# EAGLE design tester (EAGLE 6.3)
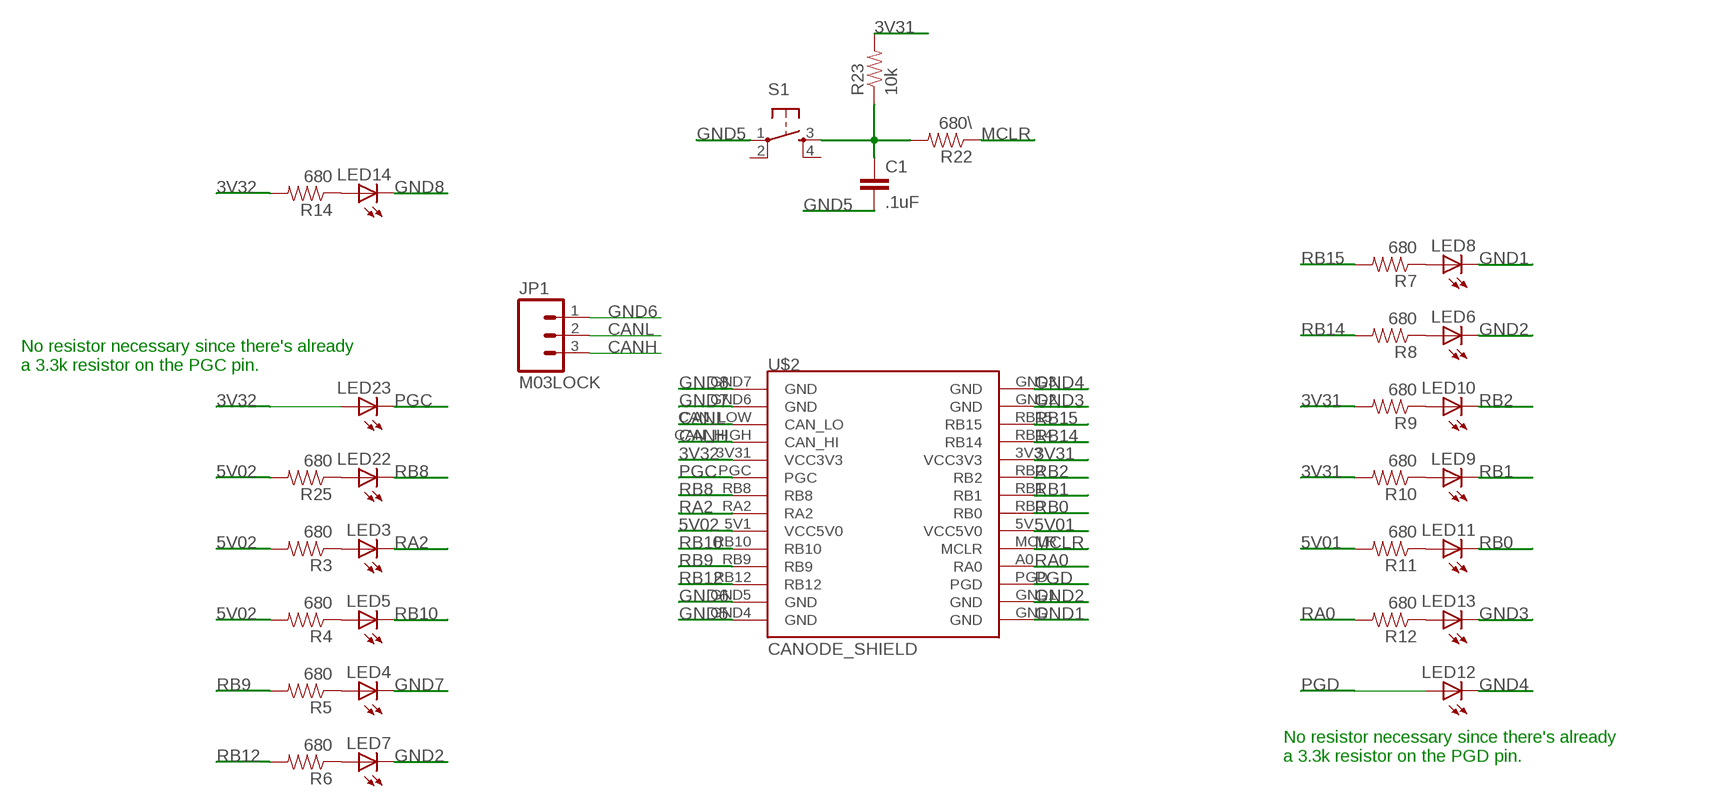
[diagram p0: schematic, sheet 1]

## Parts
C1  .1uF  CAP1206  [1206]
JP1  M03LOCK  [1X03_LOCK]
LED3  LED1206  [LED-1206]
LED4  LED1206  [LED-1206]
LED5  LED1206  [LED-1206]
LED6  LED1206  [LED-1206]
LED7  LED1206  [LED-1206]
LED8  LED1206  [LED-1206]
LED9  LED1206  [LED-1206]
LED10  LED1206  [LED-1206]
LED11  LED1206  [LED-1206]
LED12  LED1206  [LED-1206]
LED13  LED1206  [LED-1206]
LED14  LED1206  [LED-1206]
LED22  LED1206  [LED-1206]
LED23  LED1206  [LED-1206]
R3  680  RESISTOR0805-RES  [0805]
R4  680  RESISTOR0805-RES  [0805]
R5  680  RESISTOR0805-RES  [0805]
R6  680  RESISTOR0805-RES  [0805]
R7  680  RESISTOR0805-RES  [0805]
R8  680  RESISTOR0805-RES  [0805]
R9  680  RESISTOR0805-RES  [0805]
R10  680  RESISTOR0805-RES  [0805]
R11  680  RESISTOR0805-RES  [0805]
R12  680  RESISTOR0805-RES  [0805]
R14  680  RESISTOR0805-RES  [0805]
R22  680\  RESISTOR0805-RES  [0805]
R23  10k  RESISTOR0805-RES  [0805]
R25  680  RESISTOR0805-RES  [0805]
S1  TAC_SWITCHPTH  [B3F-1020]
U$2  CANODE_SHIELD  [CANODE_SHIELD]

## Nets
3V31: R9.2 R10.2 R23.2 U$2.3V3(VCC3V3)
3V32: LED23.A R14.2 U$2.3V31(VCC3V3)
5V01: R11.2 U$2.5V(VCC5V0)
5V02: R3.2 R4.2 R25.2 U$2.5V1(VCC5V0)
CANH [small]: JP1.3 U$2.CAN_HIGH(CAN_HI)
CANL: JP1.2 U$2.CAN_LOW(CAN_LO)
GND1 [small]: LED8.C U$2.GND
GND2 [small]: LED6.C LED7.C U$2.GND1(GND)
GND3 [small]: LED13.C U$2.GND2(GND)
GND4: LED12.C U$2.GND3(GND)
GND5: C1.2 S1.1 U$2.GND4(GND)
GND6: JP1.1 U$2.GND5(GND)
GND7: LED4.C U$2.GND6(GND)
GND8: LED14.C U$2.GND7(GND)
MCLR [small]: R22.1 U$2.MCLR
N$1: C1.1 R22.2 R23.1 S1.3
N$2: LED22.A R25.1
N$4: LED3.A R3.1
N$5: LED4.A R5.1
N$6: LED5.A R4.1
N$7: LED6.A R8.1
N$8: LED7.A R6.1
N$9: LED8.A R7.1
N$10: LED9.A R10.1
N$11: LED10.A R9.1
N$12: LED11.A R11.1
N$14: LED13.A R12.1
N$15: LED14.A R14.1
PGC [small]: LED23.C U$2.PGC
PGD [small]: LED12.A U$2.PGD
RA0: R12.2 U$2.A0(RA0)
RA2 [small]: LED3.C U$2.RA2
RB0 [small]: LED11.C U$2.RB0
RB1: LED9.C U$2.RB1
RB2 [small]: LED10.C U$2.RB2
RB8: LED22.C U$2.RB8
RB9: R5.2 U$2.RB9
RB10 [small]: LED5.C U$2.RB10
RB12: R6.2 U$2.RB12
RB14 [small]: R8.2 U$2.RB14
RB15: R7.2 U$2.RB15
Unconnected: S1.2 S1.4

## Notes on the sheet
- No resistor necessary since there's already 
  a 3.3k resistor on the PGC pin.
- No resistor necessary since there's already 
  a 3.3k resistor on the PGD pin.

## Library data of the parts
C1 = ASL:CAP: Capacitor Standard 0603 ceramic capacitor, and 0.1" leaded capacitor.
JP1 = ASL:M03: Header 3 Standard 3-pin 0.1" header. Use with straight break away headers (SKU : PRT-00116), right angle break away headers (PRT-00553), swiss pins (PRT-00743), machine pins (PRT-00117), and female headers (PRT-00115). Molex polarized connector foot print use with SKU : PRT-08232 with associated crimp pins and housings.
LED3-LED14 LED22 LED23 = ASL:LED: LEDs Standard schematic elements and footprints for 5mm, 3mm, 1206, and 0603 sized LEDs. 5mm - Spark Fun Electronics SKU : COM-00529 (and others)
R3-R12 R14 R22 R23 R25 = ASL:RESISTOR: Resistor Basic schematic elements and footprints for 0603, 1206, and PTH resistors.
S1 = ASL:TAC_SWITCH: Momentary Switch Button commonly used for reset or general input. Spark Fun Electronics SKU : COM-00097
U$2 = ASL:CANODE_SHIELD: This part provides an outline of the CANode to facilitate developing shield boards. Note that this does not show the position of the mounting holes for the 4-40 screws, which should be .12" holes centered in the 4 circles in the corners.

## Net classes
0 default: width 0.203 mm
1 small: width 0.203 mm

## Board
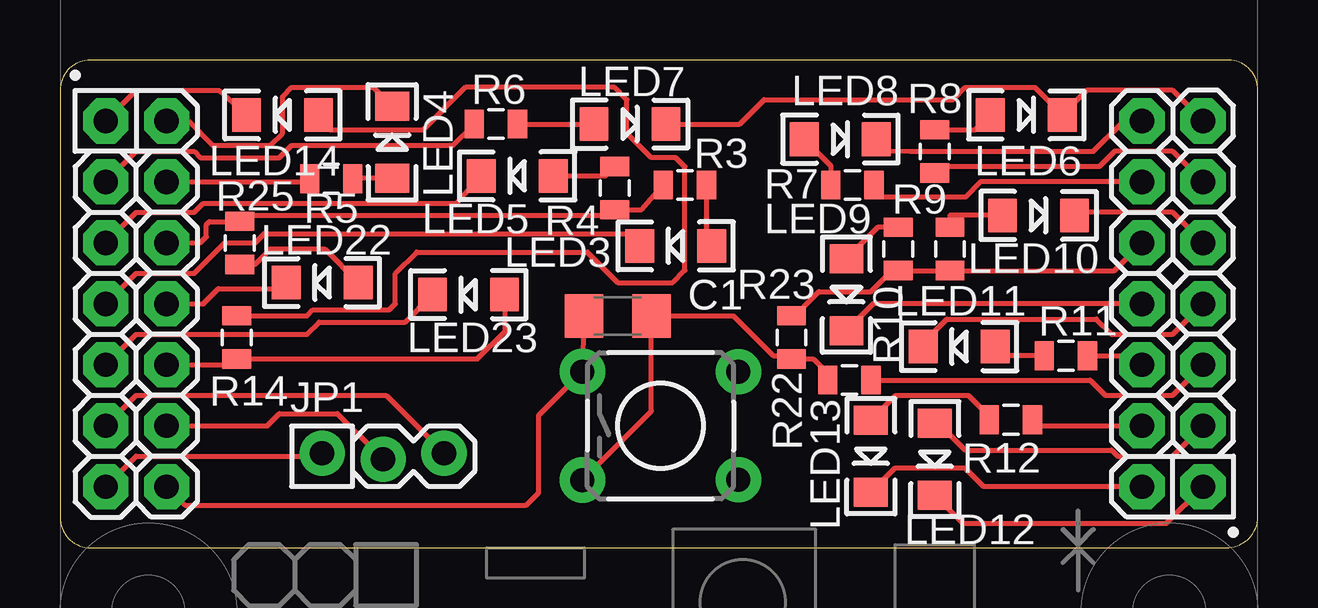
[diagram p1: board, top side]

Size 49.91 x 20.32 mm. Coordinates in mm from the lower left corner, seen from the top.
Outline: 0,19.05 0,1.27 arc90 1.27,0 48.69,0 arc90 49.91,1.4 49.91,19.05 arc90 48.69,20.32 1.27,20.32 arc90 0,19.05
Copper layers (1*16): Top 0.035mm / dielectric 1.5mm / Bottom 0.035mm
Design rules "default *": minimum track width 8mil, minimum drill 0.6mm, track to track 10mil, track to pad 8mil, pad to pad 10mil, via to via 10mil, smd to smd 8mil, copper to edge 0mil, drill to drill 8mil, minimum pad ring 10mil, minimum via ring 8mil, stop-mask expansion 4mil, vias tented up to drill 0mil, thermal gap 10mil

### Footprints (pad centres in the part's own frame; a part is rotated, then mirrored left to right if it is on the bottom)
1206 = smd 1.6 x 1.8: 1 -1.4,0; 2 1.4,0
1X03_LOCK = drill 1.016 pad 1.88: 1 0,0.127; 2 2.54,-0.127; 3 5.08,0.127
LED-1206 = smd 1.2 x 1.4: A -1.5,0; C 1.5,0
0805 = smd 0.8 x 1.2: 1 -0.9,0; 2 0.9,0
B3F-1020 = drill 1 pad 1.88: 1 -3.25,2.261; 2 3.25,2.25; 3 -3.25,-2.261; 4 3.25,-2.25
CANODE_SHIELD = drill 1.016 pad 1.88 octagon: 3V3 45.085,19.05; 3V31 4.445,13.97; 5V 45.085,13.97; 5V1 4.445,19.05; A0 45.085,11.43; CAN_HIGH 1.905,11.43; CAN_LOW 4.445,11.43; GND 45.085,24.13; GND1 47.625,24.13; GND2 45.085,8.89; GND3 47.625,8.89; GND4 4.445,8.89; GND5 1.905,8.89; GND6 4.445,24.13; GND7 1.905,24.13; MCLR 47.625,13.97; PGC 1.905,13.97; PGD 47.625,11.43; RA2 1.905,16.51; RB0 47.625,16.51; RB1 45.085,16.51; RB2 47.625,19.05; RB8 4.445,16.51; RB9 4.445,21.59; RB10 1.905,19.05; RB12 1.905,21.59; RB14 47.625,21.59; RB15 45.085,21.59

### Placement (x,y rotation side)
C1  23.24,9.65 180 top
JP1  10.92,3.81 0 top
LED3  25.65,12.57 180 top
LED4  13.84,16.89 90 top
LED5  19.05,15.49 180 top
LED6  40.26,18.03 0 top
LED7  23.75,17.65 0 top
LED8  32.51,17.02 0 top
LED9  32.77,10.54 270 top
LED10  40.77,13.84 0 top
LED11  37.47,8.38 180 top
LED12  36.45,3.68 270 top
LED13  33.78,3.81 270 top
LED14  9.27,18.03 180 top
LED22  10.92,11.05 180 top
LED23  17.02,10.54 180 top
R3  26.04,15.11 180 top
R4  23.11,14.99 270 top
R5  11.3,15.37 180 top
R6  18.16,17.65 180 top
R7  33.02,15.11 0 top
R8  36.45,16.51 270 top
R9  37.08,12.45 270 top
R10  34.92,12.45 270 top
R11  41.91,8 0 top
R12  39.62,5.33 0 top
R14  7.37,8.76 270 top
R22  32.89,6.99 180 top
R23  30.48,8.76 90 top
R25  7.49,12.7 90 top
S1  25.02,5.08 0 top
U$2  0,-6.35 0 top

### Tracks (layer width: path | path; a pad name or v marks a point on that pad's centre or on a via)
3V31
  Top 0.203: U$2.3V3 43.93,11.55 R9.2 R10.2 34.66,11.55 33.78,10.67 31.62,10.67 30.99,10.03 R23.2
3V32
  Top 0.203: U$2.3V31 7.12,7.62 R14.2 17.39,7.86 18.54,9.02 18.54,10.52 LED23.A
5V01
  Top 0.203: R11.2 44.7,8 U$2.5V
5V02
  Top 0.203: R3.2 24.23,14.09 R4.2 22.87,13.84 7.48,13.84 R25.2 7.23,13.59 6.22,13.59 6.1,13.46 6.1,12.95 5.84,12.7 U$2.5V1
CANH
  Top 0.203: U$2.CAN_HIGH 3.17,6.35 13.59,6.35 JP1.3
CANL
  Top 0.203: U$2.CAN_LOW 8.64,5.08 9.14,5.59 11.56,5.59 JP1.2
GND1
  Top 0.203: LED8.C 34.52,16.53 35.43,16.51 43.05,16.51 44.2,17.65 44.83,17.65 U$2.GND
GND2
  Top 0.203: U$2.GND1 46.35,19.05 42.77,19.05 LED6.C 40.62,19.18 37.72,19.18 37.21,18.67 29.34,18.67 28.32,17.65 LED7.C
GND3
  Top 0.203: U$2.GND2 38.48,2.54 37.72,3.3 34.77,3.3 LED13.C
GND4
  Top 0.203: LED12.C 37.62,1.02 46.1,1.02 U$2.GND3
GND5
  Top 0.203: C1.2 21.77,7.68 S1.1 19.94,5.51 19.94,2.29 19.43,1.78 5.21,1.78 U$2.GND4
GND6
  Top 0.203: U$2.GND5 3.17,3.81 10.79,3.81 JP1.1
GND7
  Top 0.203: U$2.GND6 5.33,17.78 6.35,16.76 8.76,16.76 9.27,17.27 9.27,18.8 9.65,19.18 13.06,19.18 LED4.C
GND8
  Top 0.203: U$2.GND7 3.17,19.05 6.63,19.05 LED14.C
MCLR
  Top 0.203: R22.1 42.93,6.99 43.56,6.35 46.35,6.35 U$2.MCLR
N$1
  Top 0.203: 31.99,7.12 R22.2 31.75,7.23 31.75,7.49 31.38,7.86 R23.1 arc45 30.15,8 29.72,8 28.07,9.65 C1.1 24.64,5.69 S1.3
N$2
  Top 0.203: LED22.A 11.03,12.45 8.77,12.45 8.13,11.8 R25.1
N$4
  Top 0.203: R3.1 26.93,12.79 LED3.A
N$5
  Top 0.203: LED4.A 12.35,15.39 R5.1
N$6
  Top 0.203: LED5.A 22.72,15.49 R4.1
N$7
  Top 0.203: R8.1 38.13,17.41 LED6.A
N$8
  Top 0.203: R6.1 LED7.A
N$9
  Top 0.203: LED8.A 32.12,15.91 R7.1
N$10
  Top 0.203: R10.1 34.07,13.35 LED9.A
N$11
  Top 0.203: LED10.A 37.07,13.84 R9.1
N$12
  Top 0.203: R11.1 39.35,8 LED11.A
N$14
  Top 0.203: LED13.A 34.82,6.35 37.85,6.35 38.35,5.84 38.73,5.45 R12.1
N$15
  Top 0.203: R14.1 10.3,9.66 10.54,9.91 13.72,9.91 13.97,10.16 13.97,11.43 14.86,12.32 21.97,12.32 23.24,11.05 25.53,11.05 26.04,11.56 26.04,15.88 25.65,16.26 24.64,16.26 23.62,17.27 23.62,18.67 23.11,19.18 16.89,19.18 15.11,17.4 11.28,17.4 LED14.A
PGC
  Top 0.203: U$2.PGC 3.17,8.89 10.29,8.89 10.79,9.4 14.38,9.4 LED23.C
PGD
  Top 0.203: LED12.A 36.6,5.18 37.72,4.06 43.81,4.06 44.07,3.81 46.35,3.81 U$2.PGD
RA0
  Top 0.203: R12.2 40.78,5.08 U$2.A0
RA2
  Top 0.203: U$2.RA2 3.17,11.43 5.59,11.43 6.86,12.7 8.13,12.7 8.51,13.08 23.65,13.08 LED3.C
RB0
  Top 0.203: LED11.C 35.97,8.53 36.96,9.53 43.18,9.53 43.81,8.89 46.35,8.89 U$2.RB0
RB1
  Top 0.203: U$2.RB1 33.88,10.16 LED9.C
RB2
  Top 0.203: U$2.RB2 46.35,13.97 42.39,13.97 LED10.C
RB8
  Top 0.203: U$2.RB8 5.97,10.16 6.6,10.79 9.17,10.79 LED22.C
RB9
  Top 0.203: U$2.RB9 10.28,15.24 R5.2
RB10
  Top 0.203: U$2.RB10 3.17,13.97 5.59,13.97 5.97,14.35 16.53,14.35 LED5.C
RB12
  Top 0.203: U$2.RB12 3.17,16.51 5.59,16.51 5.84,16.26 9.14,16.26 9.65,16.76 16.37,16.76 R6.2
RB14
  Top 0.203: U$2.RB14 46.35,16.51 43.94,16.51 43.31,15.88 36.71,15.88 R8.2
RB15
  Top 0.203: U$2.RB15 38.35,15.24 37.72,14.6 34.05,14.6 R7.2